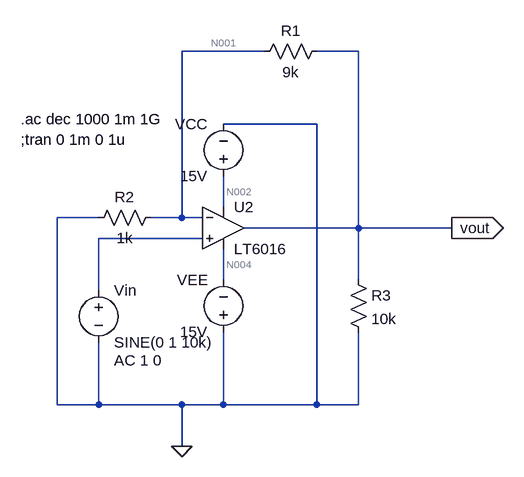
[diagram p0: schematic non-inverting amp opamp 1.asc]
* non-inverting amp opamp 1.asc
* U2: LT6016 (symbol OpAmps\LT6016 not available, pins judged from their places): In+=N003 In-=N001 V+=N002 V-=N004 OUT=vout
R1 vout N001 9k
R2 N001 0 1k
Vin N003 0 SINE(0 1 10k) AC 1 0
VCC N002 0 15V
VEE 0 N004 15V
R3 vout 0 10k
;tran 0 1m 0 1u
.ac dec 1000 1m 1G
.backanno
.end

* Results of the author's LTspice run, read from the files saved beside the schematic
* Operating Point, zero values left out:
*   V(n004) = -15 V
*   V(n002) = 15 V
*   V(vout) = 15.7 µV
*   V(n001) = -20.2 nV
*   I(R3) = 1.57 nA
*   I(R2) = -20.2 pA
*   I(R1) = 1.747 nA
*   I(Vee) = -345.9 µA
*   I(Vcc) = -345.9 µA
*   I(Vin) = -1.767 nA
*   Ix(u2:1) = 1.767 nA
*   Ix(u2:2) = 1.767 nA
*   Ix(u2:3) = 345.9 µA
*   Ix(u2:4) = -345.9 µA
*   Ix(u2:5) = -3.303 nA
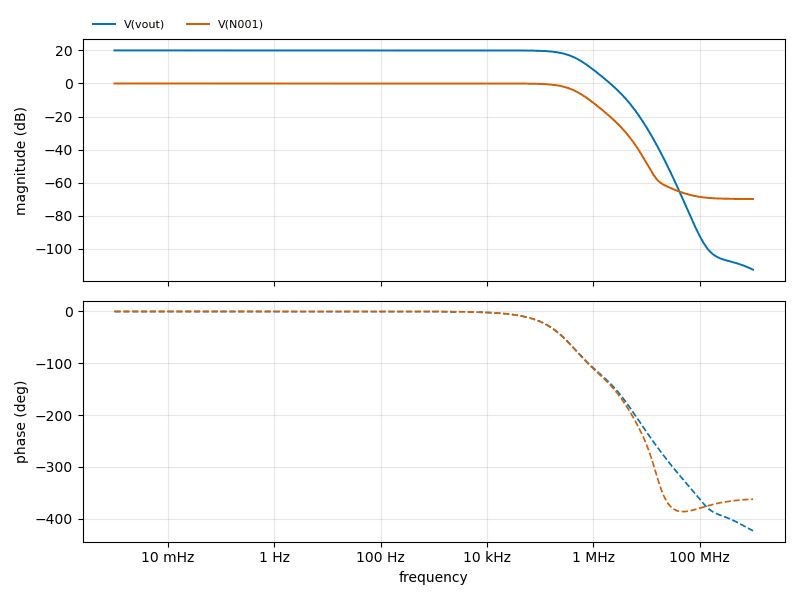
[diagram p1: AC Analysis of non-inverting amp opamp 1.asc, plotted from the saved traces]
* AC Analysis, 1 run:
*   V(vout): 20.00 dB at 1 mHz, -112.60 dB at 1 GHz, peak 20.00 dB at 1.081 mHz, 3 dB below the peak at 353.5 kHz
*   V(N001): -0.00 dB at 1 mHz, -69.84 dB at 1 GHz, peak -0.00 dB at 2 mHz, 3 dB below the peak at 353.2 kHz